# Altium schematic sheet [3]Sensor.SchDoc: Sensor
size A4; Organization: Altium Limited; Address1: SPARC Lab; Address2: SEEE-HUST; Address3: Dai Co Viet, Ha Noi; DocumentNumber: 3; SheetNumber: 3; SheetTotal: 5
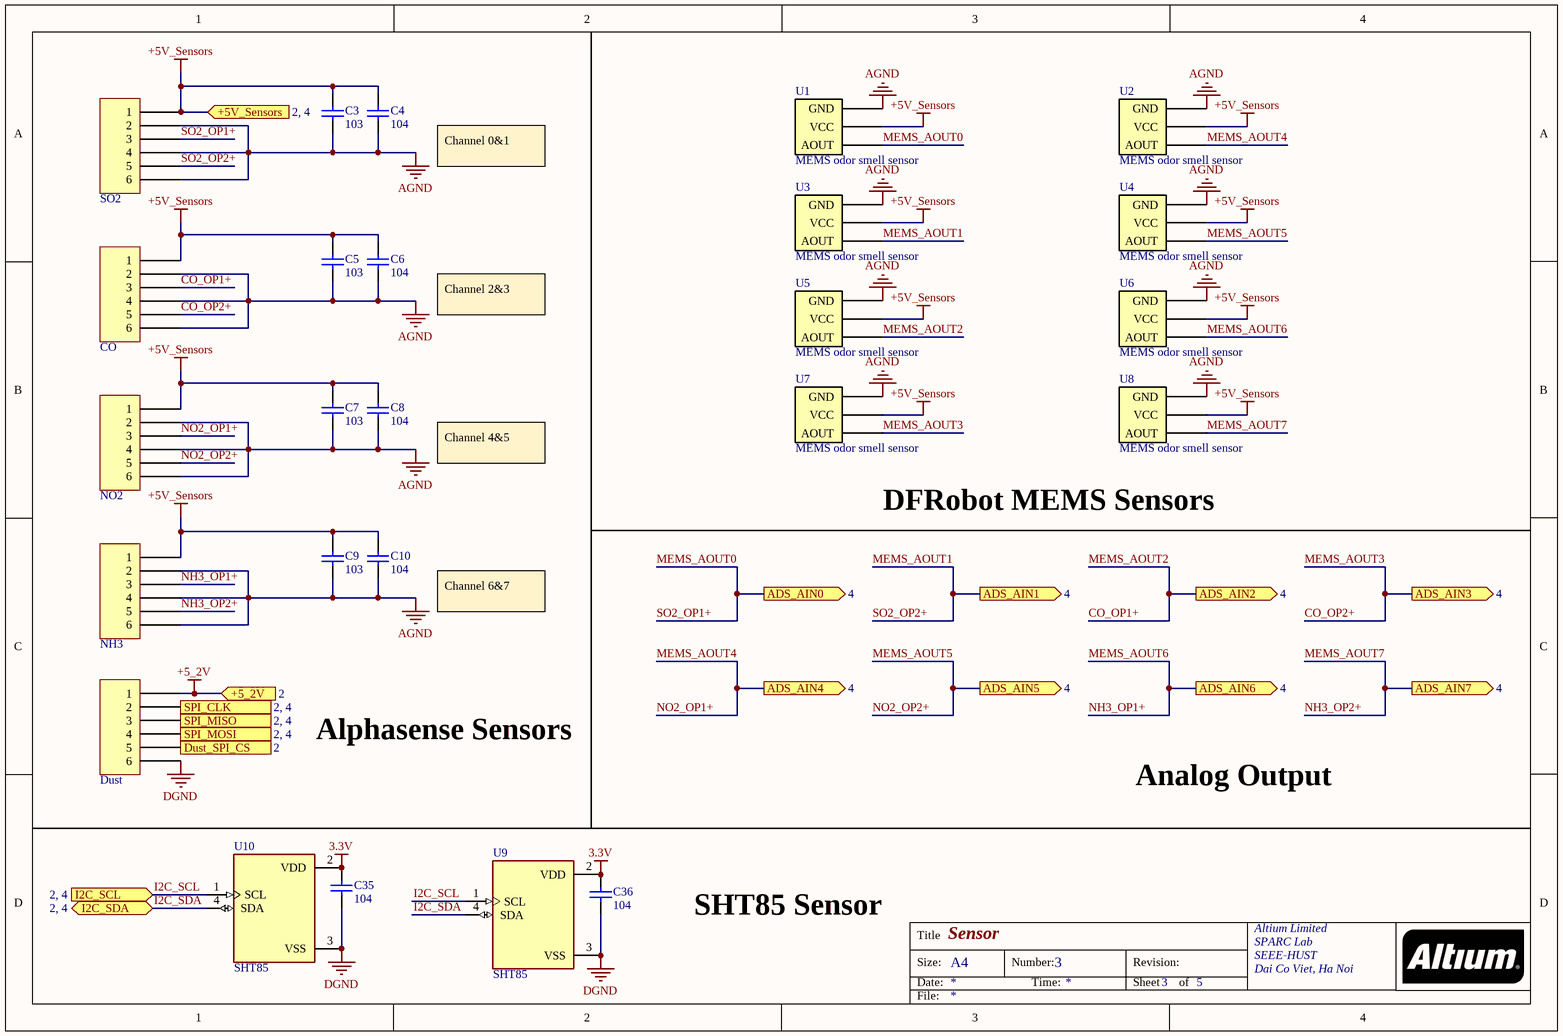
[diagram p0: [3]Sensor.SchDoc]

## Parts
C3  103  [tu 0805]
C4  104  [tu 0805]
C5  103  [tu 0805]
C6  104  [tu 0805]
C7  103  [tu 0805]
C8  104  [tu 0805]
C9  103  [tu 0805]
C10  104  [tu 0805]
C35  104  [tu 0805]
C36  104  [tu 0805]
H1  SO2  [Molex 6p]
H2  CO  [Molex 6p]
H3  NO2  [Molex 6p]
H4  NH3  [Molex 6p]
H5  Dust  [Molex 6p]
U1  MEMS odor smell sensor  [MEMS_odor_sensor]
U2  MEMS odor smell sensor  [MEMS_odor_sensor]
U3  MEMS odor smell sensor  [MEMS_odor_sensor]
U4  MEMS odor smell sensor  [MEMS_odor_sensor]
U5  MEMS odor smell sensor  [MEMS_odor_sensor]
U6  MEMS odor smell sensor  [MEMS_odor_sensor]
U7  MEMS odor smell sensor  [MEMS_odor_sensor]
U8  MEMS odor smell sensor  [MEMS_odor_sensor]
U9  SHT85  [XDCR_SHT85]
U10  SHT85  [XDCR_SHT85]

## Ports
+5_2V (in, see 2), +5V_Sensors (in, see 2, 4), ADS_AIN0 (out, see 4), ADS_AIN1 (out, see 4), ADS_AIN2 (out, see 4), ADS_AIN3 (out, see 4), ADS_AIN4 (out, see 4), ADS_AIN5 (out, see 4), ADS_AIN6 (out, see 4), ADS_AIN7 (out, see 4), Dust_SPI_CS (in, see 2), I2C_SCL (in, see 2, 4), I2C_SDA (bidir, see 2, 4), SPI_CLK (in, see 2, 4), SPI_MISO (out, see 2, 4), SPI_MOSI (in, see 2, 4)

## Nets
3.3V: C35.1 C36.1 U9.2(VDD) U10.2(VDD)
+5_2V: H5.1 ; port +5_2V
+5V_Sensors: C3.1 C4.1 C5.1 C6.1 C7.1 C8.1 C9.1 C10.1 H1.1 H2.1 H3.1 H4.1 U1.2(VCC) U2.2(VCC) U3.2(VCC) U4.2(VCC) U5.2(VCC) U6.2(VCC) U7.2(VCC) U8.2(VCC) ; port +5V_Sensors
AGND: C3.2 C4.2 C5.2 C6.2 C7.2 C8.2 C9.2 C10.2 H1.2 H1.4 H1.6 H2.2 H2.4 H2.6 H3.2 H3.4 H3.6 H4.2 H4.4 H4.6 U1.1(GND) U2.1(GND) U3.1(GND) U4.1(GND) U5.1(GND) U6.1(GND) U7.1(GND) U8.1(GND)
DGND: C35.2 C36.2 H5.6 U9.3(VSS) U10.3(VSS)
CO_OP1+: H2.3 U5.3(AOUT) ; port ADS_AIN2  [also labelled MEMS_AOUT2]
CO_OP2+: H2.5 U7.3(AOUT) ; port ADS_AIN3  [also labelled MEMS_AOUT3]
Dust_SPI_CS: H5.5 ; port Dust_SPI_CS
I2C_SCL: U9.1(SCL) U10.1(SCL) ; port I2C_SCL
I2C_SDA: U9.4(SDA) U10.4(SDA) ; port I2C_SDA
MEMS_AOUT0: H1.3 U1.3(AOUT) ; port ADS_AIN0  [also labelled SO2_OP1+]
MEMS_AOUT1: H1.5 U3.3(AOUT) ; port ADS_AIN1  [also labelled SO2_OP2+]
MEMS_AOUT4: H3.3 U2.3(AOUT) ; port ADS_AIN4  [also labelled NO2_OP1+]
MEMS_AOUT5: H3.5 U4.3(AOUT) ; port ADS_AIN5  [also labelled NO2_OP2+]
MEMS_AOUT6: H4.3 U6.3(AOUT) ; port ADS_AIN6  [also labelled NH3_OP1+]
MEMS_AOUT7: H4.5 U8.3(AOUT) ; port ADS_AIN7  [also labelled NH3_OP2+]
SPI_CLK: H5.2 ; port SPI_CLK
SPI_MISO: H5.3 ; port SPI_MISO
SPI_MOSI: H5.4 ; port SPI_MOSI

## Notes on the sheet
- Channel 0&1
- Channel 2&3
- Channel 4&5
- DFRobot MEMS Sensors
- Channel 6&7
- Alphasense Sensors
- Analog Output
- SHT85 Sensor
- Title
- Size:
- Date:
- A4
- Number:
- Time:
- Revision:
- Sheet
- of
- File:

## Library data of the parts
C3 C5 C7 C9 = Tu 0805 103 50V 10%_1: Dán; Don_Vi: Con; So_Chan: 2; Ten_Linh_Kien: Tụ 0805 102-1nF 10% 50V; Ma_Hang: MH004549; Chung_Loai: Dán; Kieu_Chan: *
C4 C6 C8 C10 C35 C36 = Tu 0805 104 50V 10%: Dán; Don_Vi: Con; So_Chan: 2; Ten_Linh_Kien: Tụ 0805 104-100nF 10% 50V; Ma_Hang: MH004551; Chung_Loai: Dán; Kieu_Chan: *
H1-H5 = Molex 6p
U1-U8 = MEMS odor smell sensor: DFRobot MEMS Odor Smell Gas Detection Sensor
U9 U10 = SHT85: Humidity Temperature Sensor 0 ~ 100% RH Digital Â±1.5% RH 8s Through Hole; MF: Sensirion AG; SnapEDA_Link: https://www.snapeda.com/parts/SHT85/Sensirion%20AG/view-part/3601545/?ref=snap; Value: *; Digi-Key_Part_Number: 1649-1110-ND; Digi-Key_Purchase_URL: https://www.digikey.com/product-detail/en/sensirion-ag/SHT85/1649-1110-ND/9666378?utm_source=snapeda&utm_medium=aggregator&utm_campaign=symbol; MP: SHT85; Package: SIP-4 Sensirion AG